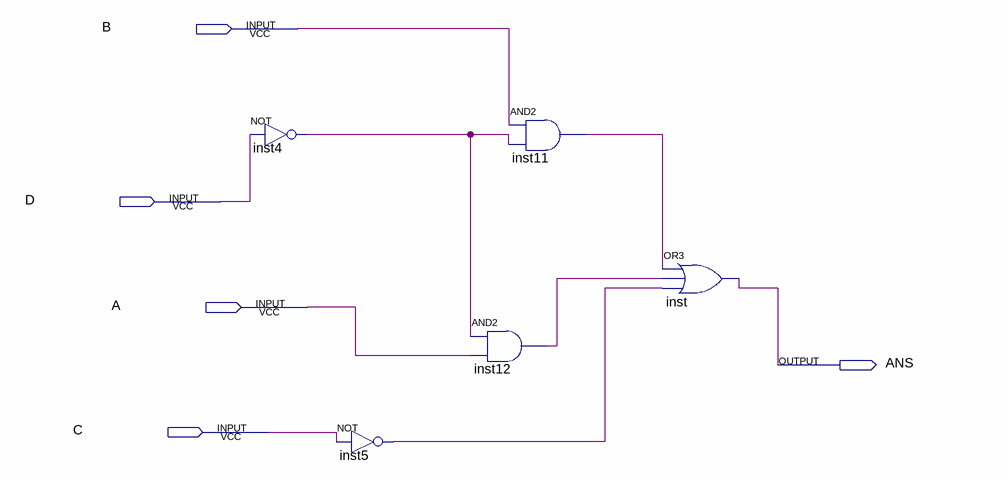
[diagram p0: schematic sheet]
// Quartus schematic EX04.bdf as structural Verilog: 5 symbols, 5 pins
module EX04 (
  input  B,
  input  D,
  input  A,
  input  C,
  output ANS
);

  wire inst4_out, inst5_out, inst11_out, inst12_out;

  not inst4 (inst4_out, D);
  not inst5 (inst5_out, C);
  and inst11 (inst11_out, B, inst4_out);
  and inst12 (inst12_out, inst4_out, A);
  or inst (ANS, inst11_out, inst12_out, inst5_out);
endmodule
